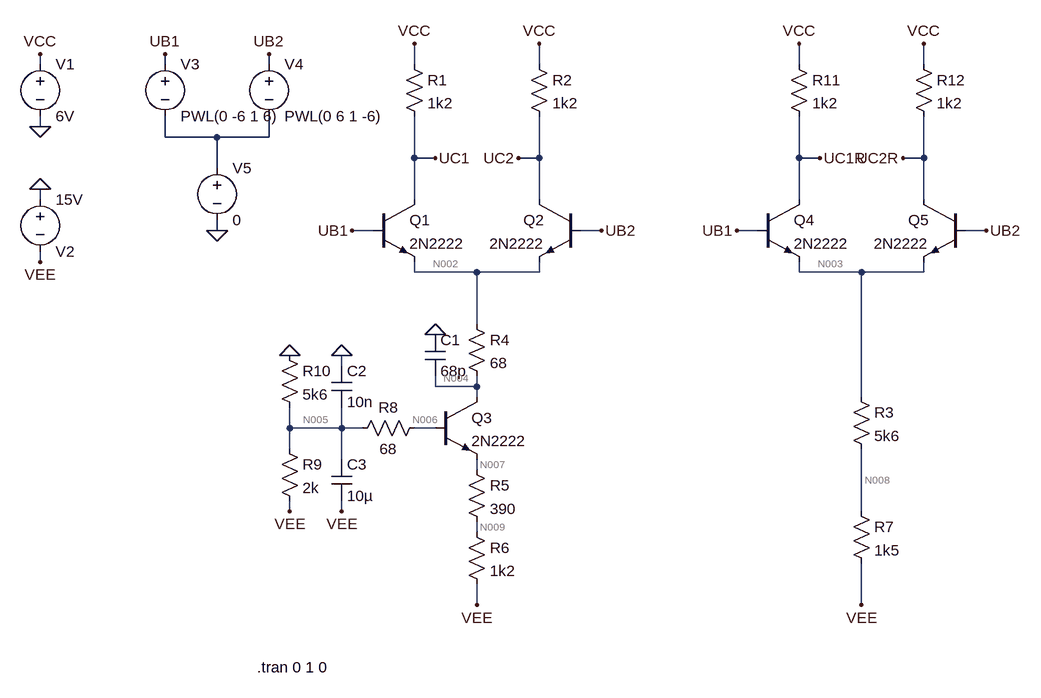
[diagram p0: schematic Draft1.asc]
Draft1.asc, the LTspice schematic file:
Version 4
SHEET 1 1332 1024
WIRE -320 0 -320 -16
WIRE -128 0 -128 -16
WIRE 32 0 32 -16
WIRE 256 0 256 -32
WIRE 448 0 448 -32
WIRE 848 0 848 -32
WIRE 1040 0 1040 -32
WIRE -320 96 -320 80
WIRE -128 112 -128 80
WIRE -48 112 -128 112
WIRE 32 112 32 80
WIRE 32 112 -48 112
WIRE 256 144 256 80
WIRE 288 144 256 144
WIRE 448 144 448 80
WIRE 448 144 416 144
WIRE 848 144 848 80
WIRE 880 144 848 144
WIRE 1040 144 1040 80
WIRE 1040 144 1008 144
WIRE -48 160 -48 112
WIRE -320 208 -320 192
WIRE 256 208 256 144
WIRE 448 208 448 144
WIRE 848 208 848 144
WIRE 1040 208 1040 144
WIRE -48 256 -48 240
WIRE 192 256 160 256
WIRE 544 256 512 256
WIRE 784 256 752 256
WIRE 1136 256 1104 256
WIRE -320 304 -320 288
WIRE 256 320 256 304
WIRE 352 320 256 320
WIRE 448 320 448 304
WIRE 448 320 352 320
WIRE 848 320 848 304
WIRE 944 320 848 320
WIRE 1040 320 1040 304
WIRE 1040 320 944 320
WIRE 352 400 352 320
WIRE 144 464 144 448
WIRE 288 496 288 480
WIRE 352 496 352 480
WIRE 352 496 288 496
WIRE 352 512 352 496
WIRE 944 512 944 320
WIRE 64 560 64 528
WIRE 144 560 144 528
WIRE 144 560 64 560
WIRE 176 560 144 560
WIRE 288 560 256 560
WIRE 64 592 64 560
WIRE 144 608 144 560
WIRE 352 624 352 608
WIRE 64 688 64 672
WIRE 144 688 144 672
WIRE 944 688 944 592
WIRE 352 720 352 704
WIRE 352 832 352 800
WIRE 944 832 944 768
FLAG -320 96 0
FLAG -320 -16 VCC
FLAG -320 192 0
FLAG -320 304 VEE
FLAG 256 -32 VCC
FLAG 448 -32 VCC
FLAG 352 832 VEE
FLAG 944 832 VEE
FLAG 288 416 0
FLAG 144 448 0
FLAG 64 448 0
FLAG 144 688 VEE
FLAG 64 688 VEE
FLAG 288 144 UC1
FLAG 416 144 UC2
FLAG 160 256 UB1
FLAG 544 256 UB2
FLAG 848 -32 VCC
FLAG 1040 -32 VCC
FLAG 880 144 UC1R
FLAG 1008 144 UC2R
FLAG 752 256 UB1
FLAG 1136 256 UB2
FLAG -48 256 0
FLAG -128 -16 UB1
FLAG 32 -16 UB2
SYMBOL voltage -320 -16 R0
WINDOW 123 0 0 Left 2
WINDOW 39 0 0 Left 2
SYMATTR InstName V1
SYMATTR Value 6V
SYMBOL res 240 -16 R0
SYMATTR InstName R1
SYMATTR Value 1k2
SYMBOL res 432 -16 R0
SYMATTR InstName R2
SYMATTR Value 1k2
SYMBOL npn 192 208 R0
SYMATTR InstName Q1
SYMATTR Value 2N2222
SYMBOL npn 512 208 M0
SYMATTR InstName Q2
SYMATTR Value 2N2222
SYMBOL npn 288 512 R0
SYMATTR InstName Q3
SYMATTR Value 2N2222
SYMBOL res 928 496 R0
SYMATTR InstName R3
SYMATTR Value 5k6
SYMBOL voltage -320 192 R0
WINDOW 0 24 96 Left 2
WINDOW 3 24 16 Left 2
WINDOW 123 0 0 Left 2
WINDOW 39 0 0 Left 2
SYMATTR InstName V2
SYMATTR Value 15V
SYMBOL res 336 384 R0
SYMATTR InstName R4
SYMATTR Value 68
SYMBOL res 336 608 R0
SYMATTR InstName R5
SYMATTR Value 390
SYMBOL res 336 704 R0
SYMATTR InstName R6
SYMATTR Value 1k2
SYMBOL res 928 672 R0
SYMATTR InstName R7
SYMATTR Value 1k5
SYMBOL cap 272 416 R0
SYMATTR InstName C1
SYMATTR Value 68p
SYMBOL res 272 544 R90
WINDOW 0 0 56 VBottom 2
WINDOW 3 32 56 VTop 2
SYMATTR InstName R8
SYMATTR Value 68
SYMBOL cap 128 464 R0
SYMATTR InstName C2
SYMATTR Value 10n
SYMBOL cap 128 608 R0
SYMATTR InstName C3
SYMATTR Value 10µ
SYMBOL res 48 576 R0
SYMATTR InstName R9
SYMATTR Value 2k
SYMBOL res 48 432 R0
SYMATTR InstName R10
SYMATTR Value 5k6
SYMBOL res 832 -16 R0
SYMATTR InstName R11
SYMATTR Value 1k2
SYMBOL res 1024 -16 R0
SYMATTR InstName R12
SYMATTR Value 1k2
SYMBOL npn 784 208 R0
SYMATTR InstName Q4
SYMATTR Value 2N2222
SYMBOL npn 1104 208 M0
SYMATTR InstName Q5
SYMATTR Value 2N2222
SYMBOL voltage -128 -16 R0
WINDOW 123 0 0 Left 2
WINDOW 39 0 0 Left 2
SYMATTR InstName V3
SYMATTR Value PWL(0 -6 1 6)
SYMBOL voltage 32 -16 R0
WINDOW 123 0 0 Left 2
WINDOW 39 0 0 Left 2
SYMATTR InstName V4
SYMATTR Value PWL(0 6 1 -6)
SYMBOL voltage -48 144 R0
WINDOW 123 0 0 Left 2
WINDOW 39 0 0 Left 2
SYMATTR InstName V5
SYMATTR Value 0
TEXT 14 928 Left 2 !.tran 0 1 0

The netlist it stands for:
* Draft1.asc
V1 VCC 0 6V
R1 VCC UC1 1k2
R2 VCC UC2 1k2
Q1 UC1 UB1 N002 0 2N2222
Q2 UC2 UB2 N002 0 2N2222
Q3 N004 N006 N007 0 2N2222
R3 N003 N008 5k6
V2 0 VEE 15V
R4 N002 N004 68
R5 N007 N009 390
R6 N009 VEE 1k2
R7 N008 VEE 1k5
C1 0 N004 68p
R8 N006 N005 68
C2 0 N005 10n
C3 N005 VEE 10µ
R9 N005 VEE 2k
R10 0 N005 5k6
R11 VCC UC1R 1k2
R12 VCC UC2R 1k2
Q4 UC1R UB1 N003 0 2N2222
Q5 UC2R UB2 N003 0 2N2222
V3 UB1 N001 PWL(0 -6 1 6)
V4 UB2 N001 PWL(0 6 1 -6)
V5 N001 0 0
.model NPN NPN
.model PNP PNP
.lib standard.bjt
.tran 0 1 0
.backanno
.end

* Results of the author's LTspice run, read from the files saved beside the schematic
* Operating Point, zero values left out:
*   V(vcc) = 6 V
*   V(uc1) = 6 V
*   V(uc2) = 5.293 V
*   V(ub1) = -6 V
*   V(n002) = 5.282 V
*   V(ub2) = 6 V
*   V(n004) = 5.143 V
*   V(n006) = -11.07 V
*   V(n007) = -11.74 V
*   V(n003) = 5.264 V
*   V(n008) = -10.72 V
*   V(vee) = -15 V
*   V(n009) = -12.54 V
*   V(n005) = -11.07 V
*   V(uc1r) = 6 V
*   V(uc2r) = 5.274 V
*   Ic(Q5) = 605.2 µA
*   Ib(Q5) = 2.249 mA
*   Ie(Q5) = -2.854 mA
*   Ic(Q4) = 12.01 pA
*   Ib(Q4) = -23.27 pA
*   Ie(Q4) = 11.26 pA
*   Ic(Q3) = 2.044 mA
*   Ib(Q3) = 8.844 µA
*   Ie(Q3) = -2.052 mA
*   Ic(Q2) = 589.2 µA
*   Ib(Q2) = 1.454 mA
*   Ie(Q2) = -2.044 mA
*   Ic(Q1) = 12.01 pA
*   Ib(Q1) = -23.29 pA
*   Ie(Q1) = 11.28 pA
*   I(R12) = 605.2 µA
*   I(R11) = 12 pA
*   I(R10) = 1.976 mA
*   I(R9) = 1.967 mA
*   I(R8) = -8.844 µA
*   I(R7) = 2.854 mA
*   I(R6) = 2.052 mA
*   I(R5) = 2.052 mA
*   I(R4) = 2.044 mA
*   I(R3) = 2.854 mA
*   I(R2) = 589.2 µA
*   I(R1) = 12 pA
*   I(V5) = -3.703 mA
*   I(V4) = -3.703 mA
*   I(V3) = 46.55 pA
*   I(V2) = -6.874 mA
*   I(V1) = -1.194 mA
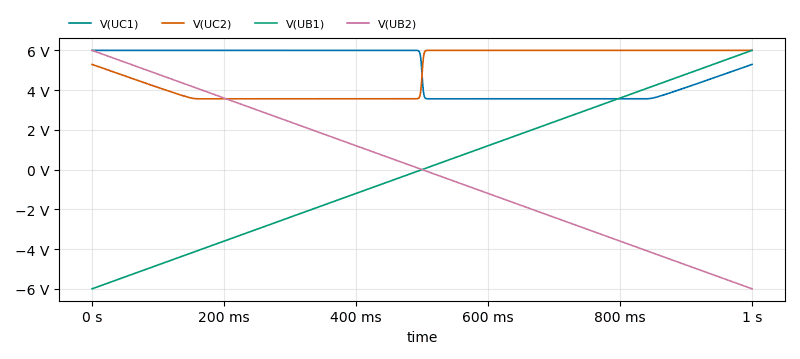
[diagram p1: Transient Analysis of Draft1.asc, plotted from the saved traces]
* Transient Analysis, 1 run:
*   V(UC1): min 3.561 V, max 6 V, average 4.91 V, rms 5.041 V, last 5.293 V
*   V(UC2): min 3.561 V, max 6 V, average 4.91 V, rms 5.041 V, last 6 V
*   V(UB1): min -6 V, max 6 V, average 0 V, rms 3.51 V, last 6 V
*   V(UB2): min -6 V, max 6 V, average 0 V, rms 3.51 V, last -6 V